# EAGLE schematic ZabavyBulb (EAGLE 7.6.0)
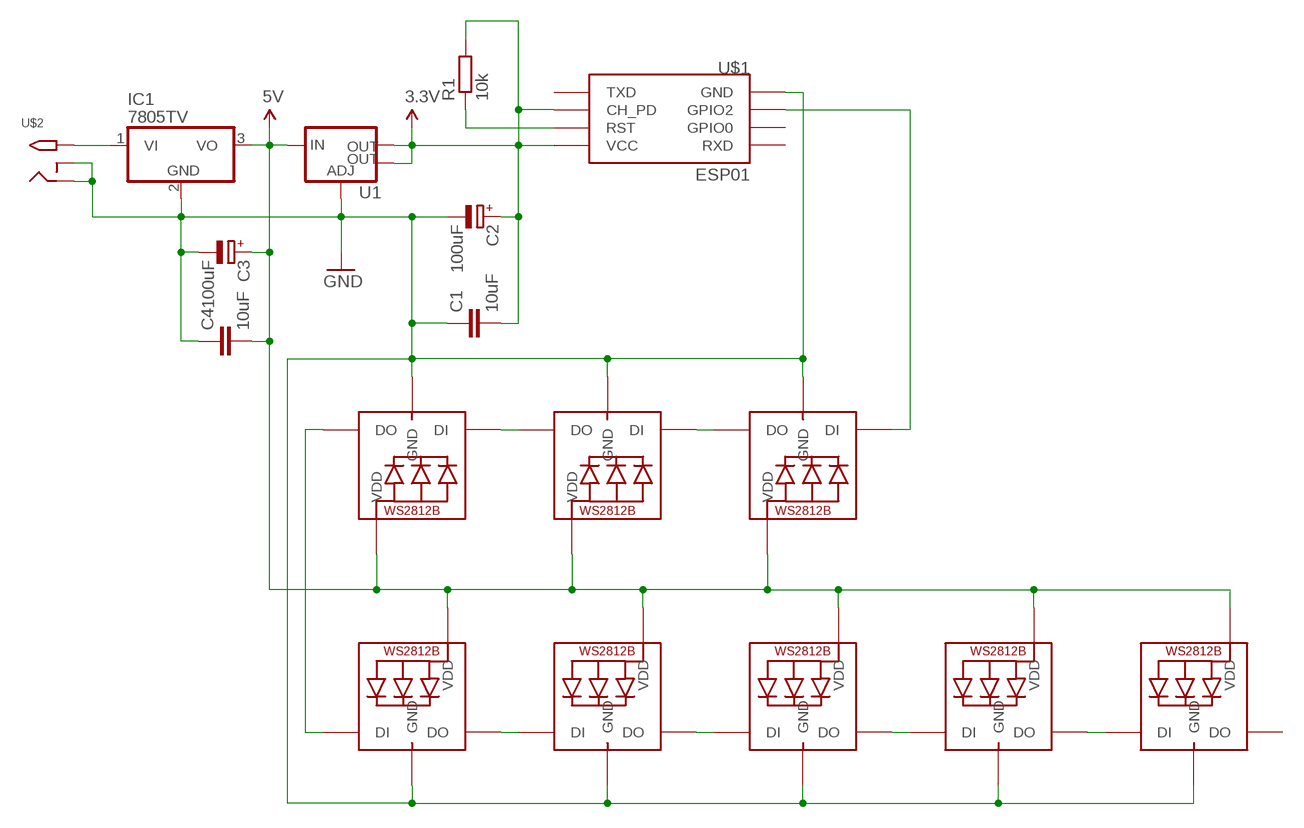
[diagram p0: schematic, sheet 1]

## Parts
C1  10uF  C-EU050-024X044  [C050-024X044]
C2  100uF  CPOL-EUE2.5-6  [E2,5-6]
C3  100uF  CPOL-EUE2.5-6  [E2,5-6]
C4  10uF  C-EU050-024X044  [C050-024X044]
IC1  7805TV  [TO220V]
LED1  WS2812B3535  [LED3535]
LED2  WS2812B3535  [LED3535]
LED3  WS2812B3535  [LED3535]
LED4  WS2812B3535  [LED3535]
LED5  WS2812B3535  [LED3535]
LED6  WS2812B3535  [LED3535]
LED7  WS2812B3535  [LED3535]
LED8  WS2812B3535  [LED3535]
R1  10k  R-EU_0207/10  [0207/10]
U1  V_REG_LM1117SOT223  [SOT223]
U$1  ESP01  [ESP01]
U$2  2.1MMJACKTHM  [PJ-102A]

## Nets
3.3V: C1.2 C2.+ R1.2 U1.2(OUT) U1.4(OUT) U$1.CH_PD U$1.VCC
5V: C3.+ C4.2 IC1.3(VO) LED1.2(VDD) LED2.2(VDD) LED3.2(VDD) LED4.2(VDD) LED5.2(VDD) LED6.2(VDD) LED7.2(VDD) LED8.2(VDD) U1.3(IN)
GND: C1.1 C2.- C3.- C4.1 IC1.2(GND) LED1.4(GND) LED2.4(GND) LED3.4(GND) LED4.4(GND) LED5.4(GND) LED6.4(GND) LED7.4(GND) LED8.4(GND) U1.1(ADJ) U$1.GND U$2.RING U$2.RING_SW
N$6: IC1.1(VI) U$2.TIP
N$8: R1.1 U$1.RST
N$9: LED1.1(DI) U$1.GPIO2
N$11: LED2.3(DO) LED3.1(DI)
N$12: LED1.3(DO) LED2.1(DI)
N$13: LED3.3(DO) LED4.1(DI)
N$15: LED4.3(DO) LED5.1(DI)
N$16: LED5.3(DO) LED6.1(DI)
N$17: LED6.3(DO) LED7.1(DI)
N$18: LED7.3(DO) LED8.1(DI)
Unconnected: LED8.3(DO) U$1.GPIO0 U$1.RX(RXD) U$1.TX(TXD)

## Library data of the parts
C1 C4 = rcl:C-EU: CAPACITOR, European symbol
C2 C3 = rcl:CPOL-EU: POLARIZED CAPACITOR, European symbol
IC1 = linear:78*: Positive VOLTAGE REGULATOR Source: http://cache.national.com/ds/LM/LM78L05.pdf http://www.fairchildsemi.com/ds/LM/LM7805.pdf
LED1-LED8 = adafruit:WS2812B
R1 = resistor:R-EU_: RESISTOR, European symbol
U1 = SparkFun-PowerIC:V_REG_LM1117: Voltage Regulator LM1117 Standard adjustable voltage regulator but in SMD form. Spark Fun Electronics SKU : COM-00595; PROD_ID: VREG-08170
U$1 = esp8266modules:ESP01: ESP8266 Wifi module 01
U$2 = adafruit:2.1MMJACK: 2.1mm x 5.5mm THM DC jack with internal switch. Digikey part #PJ-102A, 4UCON part #05537 2.1mm x 5.5mm SMT DC jack with internal switch. Digikey part #PJ-002A-SMT, 4UCON part #03267 By microbuilder.eu & adafruit.com